# Altium project Power Converter 12V as TO-3 replacement.PrjPcb
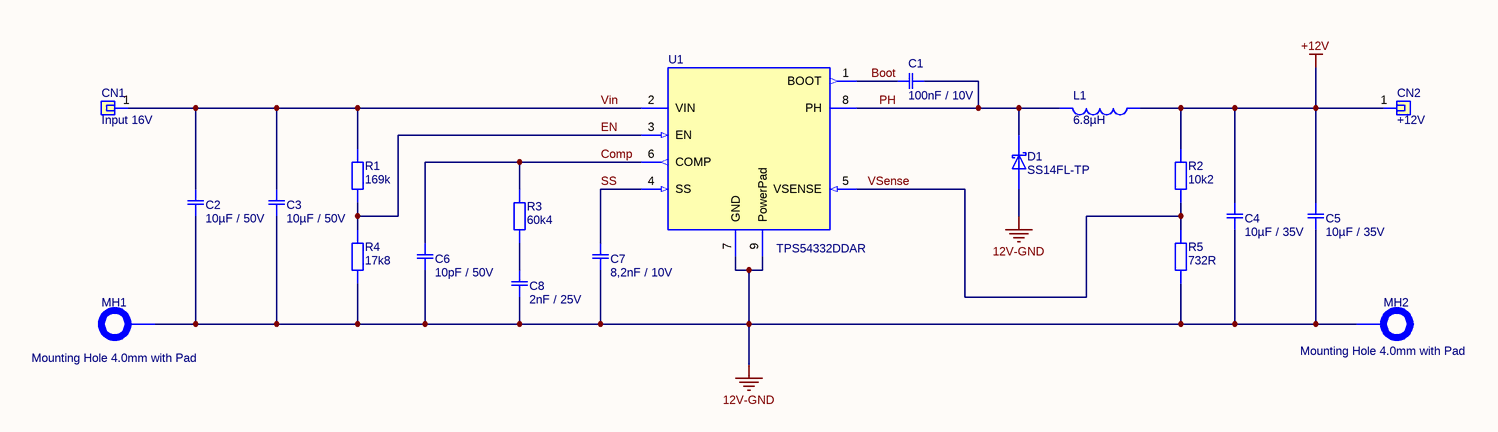
[diagram p0: Power Converter 12V as TO-3 replacement.SchDoc]
Author: PCB-Tech; Revision: A; Title: Projektname; Version: 1.0
1 sheet, 20 parts. Net scope: global (net labels, ports and power ports of the same name join across sheets).
Board file: Power Converter 12V as TO-3 replacement.PcbDoc

## Sheet Power Converter 12V as TO-3 replacement.SchDoc: Projektname
size 297 x 209 mm; ApprovedBy: .; CheckedBy: .; Author: DiWou; CompanyName: DL2DW; DrawnBy: DiWou; Engineer: .; Organization: DL2DW; DocumentNumber: 1; Revision: -; SheetNumber: 1; SheetTotal: 1; DrawnDate: 06.08.2020; EngrDate: .; ChkdDate: .; Title1: Power Converter 12V as TO-3 replacement; Title2: .; Title3: .; Desc1: Version 1.0; Desc2: .; ApprDate: .

### Parts
C1  100nF / 10V  [CAP CER SMD 0402 100nF 10V Murata GRM155R71A104KA01D]
C2  10µF / 50V  [CAP SMD 10µF 50V 1210 TDK C3225X7R1H106M250AC]
C3  10µF / 50V  [CAP SMD 10µF 50V 1210 TDK C3225X7R1H106M250AC]
C4  10µF / 35V  [CAP SMD 10µF 50V 1210 TDK C3216X6S1V106K160AC]
C5  10µF / 35V  [CAP SMD 10µF 50V 1210 TDK C3216X6S1V106K160AC]
C6  10pF / 50V  [CAP CER SMD 0805 10pF 50V Samsung CL21C100JBANNNC]
C7  8,2nF / 10V  [CAP CER SMD 0201 8,2nF 10V Murata GRM033R71A822KA01D]
C8  2nF / 25V  [CAP CER SMD 0805 2nF 25V Kemet C0805C202J3GACTU]
CN1  Input 16V  [Printed Circuit Pin 1.02mm 3125-2-00-80-00-00-08-0]
CN2  +12V  [Printed Circuit Pin 1.02mm 3125-2-00-80-00-00-08-0]
D1  SS14FL-TP  [SS14FL]
L1  6.8µH  [Shielded Drum Core 6.8µH TDK B82464G4682M]
MH1  Mounting Hole 4.0mm with Pad  [Mounting Hole 4mm with Pad]  (no BOM)
MH2  Mounting Hole 4.0mm with Pad  [Mounting Hole 4mm with Pad]  (no BOM)
R1  169k  [RES SMD 0402 169k Vishay CRCW0402169KFKED]
R2  10k2  [RES SMD 0402 10k2 Vishay CRCW040210K2FKED]
R3  60k4  [RES SMD 0402 60k4 Vishay CRCW040260K4FKED]
R4  17k8  [RES SMD 0402 17k8 Vishay CRCW040217K8FKED]
R5  732R  [RES SMD 0402 732R Vishay CRCW0402732RFKED]
U1  TPS54332DDAR  [DC-DC Converter (Buck) TPS54332DDAR SO-Power Pad]

### Nets
12V-GND: C2.1 C3.1 C4.1 C5.1 C6.1 C7.1 C8.2 D1.2 MH1.1 MH2.1 R4.1 R5.1 U1.7(GND) U1.9(PowerPad)
+12V: C4.2 C5.2 CN2.1 L1.2 R2.2
Boot: C1.1 U1.1(BOOT)
Comp: C6.2 R3.2 U1.6(COMP)
EN: R1.1 R4.2 U1.3(EN)
PH: C1.2 D1.1 L1.1 U1.8(PH)
SS: C7.2 U1.4(SS)
Vin: C2.2 C3.2 CN1.1 R1.2 U1.2(VIN)
VSense: R2.1 R5.2 U1.5(VSENSE)
NetC8_1: C8.1 R3.1

### Notes on the sheet
- Drawn by:
- Date
- Size:
- A4
- Rev:
- Engr:
- Chkd:
- Appr:
- File:
- Document No:
- Print Date & Time:
- /
- Sheet
- of

### Library data of the parts
C1 = CMP-Capacitors-Ceramic_Capacitors-00034-2: CAP CER 0.1UF 10V X7R 0402; Tolerance: 10%; Dissipation Factor: 0.035%; Number of Pins: 2; Termination: SMD/SMT; REACH SVHC: No SVHC; Length: 1mm; Case Code (Metric): 1005; Dielectric: X7R; Capacitance: 100nF; Width: 0.02inch; Package Quantity: 1; Packaging: Tape and Reel; Height: 0.5mm; Thickness: 0.022inch; Max Operating Temperature: 125°C; Voltage: 10V; Voltage Rating (DC): 10V; Depth: 0.5mm; Case Code (Imperial): 0402; Radiation Hardening: No; Case/Package: 0402; Min Operating Temperature: -55°C; Voltage Rating: 10V; Mount: Surface Mount; Lead Free: Lead Free
C2 C3 = CMP-Capacitors-Ceramic_Capacitors-00030-1: TDK - C3225X7R1H106M250AC - C3225X7R1H106MT000E; Dielectric: X7R; Capacitance: 10uF; Tolerance: 20%; Case/Package: 1210; Package Quantity: 1000; Case Code (Imperial): 1210; Thickness: 0.11inch; Min Operating Temperature: -55°C; Width: 0.098inch; Termination: SMD/SMT; Dielectric Material: Ceramic; Case Code (Metric): 3225; Height: 2.5mm; Voltage Rating: 50V; Packaging: Tape and Reel; REACH SVHC: No SVHC; Length: 0.126inch; Voltage Rating (DC): 50V; Mount: Surface Mount; Weight: 0.000564oz; Lead Free: Lead Free; Max Operating Temperature: 125°C
C4 C5 = CMP-Capacitors-Ceramic_Capacitors-00035-1: Cap Ceramic 10uF 35V X6S 10% SMD 1206 105°C Punched Paper T/R; Lead Free: Lead Free; Weight: 0.000571oz; Height: 1.6mm; Length: 0.126inch; Voltage Rating: 35V; Packaging: Tape and Reel; Voltage Rating (DC): 35V; Mount: Surface Mount; Termination: SMD/SMT; Case/Package: 1206; Dielectric Material: Ceramic; Min Operating Temperature: -55°C; Thickness: 0.071inch; Package Quantity: 2000; Max Operating Temperature: 105°C; Capacitance: 10uF; Width: 0.063inch; Case Code (Metric): 3216; Case Code (Imperial): 1206; Dielectric: X6S; Tolerance: 10%
C6 = CMP-Capacitors-Ceramic_Capacitors-00031-1: Cap Ceramic 10pF 50VDC C0G 5% SMD 0805 Paper T/R; Max Operating Temperature: 125°C; Radiation Hardening: No; Case/Package: 0805; Case Code (Metric): 2012; Mount: Surface Mount; Contact Plating: Tin; Tolerance: 5%; Depth: 1.25mm; Case Code (Imperial): 0805; Min Operating Temperature: -55°C; Thickness: 0.03inch; Package Quantity: 1; Height: 0.65mm; Length: 2mm; Voltage Rating: 50V; Capacitance: 10pF; Packaging: Tape and Reel; Dielectric: C0G; Width: 0.049inch
C7 = CMP-Capacitors-Ceramic_Capacitors-00033-1: Multilayer Ceramic Capacitors MLCC - SMD/SMT 0.0082uF 10volts 10%; Dielectric: X7R; Capacitance: 8.2nF; Tolerance: 10%; Thickness: 0.013inch; Height: 0.3mm; Max Operating Temperature: 125°C; Voltage Rating (DC): 10V; Voltage Rating: 10V; Package Quantity: 15000; Width: 0.012inch; Min Operating Temperature: -55°C; Case Code (Imperial): 0201; Packaging: Tape and Reel; Termination: SMD/SMT; Case Code (Metric): 0603; Length: 0.6mm; Mount: Surface Mount; Radiation Hardening: No; Depth: 0.3mm; Case/Package: 0201
C8 = CMP-Capacitors-Ceramic_Capacitors-00032-1: Multilayer Ceramic Capacitors MLCC - SMD/SMT 25volts 2000pF C0G 5%; Dissipation Factor: 0.1%; Dielectric Material: Ceramic; Voltage Rating (DC): 25V; Mount: Surface Mount; Package Quantity: 4000; Case Code (Imperial): 0805; Termination: SMD/SMT; Case/Package: 0805; Dielectric: C0G; Length: 2mm; Tolerance: 5%; Packaging: Tape and Reel; Voltage Rating: 25V; Height: 0.78mm; Min Operating Temperature: -55°C; Thickness: 0.035inch; Case Code (Metric): 2012; Lead Pitch: 0.75mm; Max Operating Temperature: 125°C; Capacitance: 2nF; Depth: 1.25mm; REACH SVHC: No SVHC; Width: 1.2mm; Lead Free: Lead Free
CN1 CN2 = CMP-Mechanicals-00020-1: CONN PC PIN CIRC 0.040DIA TIN; Gender: Male; Board Thickness: 0.062inch; Hole Diameter: 1.09mm; Insulation: Non-Insulated; Mounting Hole Diameter: 0.043inch; Outside Diameter: 1.8mm; Flange Diameter: 0.071inch; Plating: Tin; Packaging: Bulk; Termination: PC Pin; Contact Material: Brass; Mount: Through Hole; Contact Plating: Tin; Length: 0.402inch; Package Quantity: 500; Material: Brass
D1 = CMP-Diodes-00014-2: DIODE SCHOTTKY 40V 1A DO221AC; Packaging: Tape and Reel; Average Rectified Current: 1A; Max Reverse Voltage (DC): 40V; Mount: Surface Mount
L1 = CMP-Inductors-00013-1: Inductor Power Shielded Wirewound 6.8uH 20% 100KHz Ferrite 4.3A 0.02Ohm DCR Automotive T/R; DC Resistance (DCR): 20mR; Self Resonant Frequency: 28MHz; Current Rating: 2A; Saturation Current: 4.6A; Max Operating Temperature: 150°C; DC Current: 4.3A; Depth: 10.4mm; Military Standard: Not; Radiation Hardening: No; Max DC Current: 4.3A; Composition: Wirewound; Package Quantity: 750; Weight: 0.070548oz; Length: 10.4mm; Core Material: Ferrite; Inductance Tolerance: 20%; Mount: Surface Mount; Width: 10.4mm; Height: 4.8mm; Test Frequency: 100kHz; Height - Seated (Max): 0.189inch; Tolerance: 20%; Termination: SMD/SMT; RMS Current (Irms): 4.3A; Packaging: Tape and Reel; Min Operating Temperature: -55°C; Inductance: 6.8uH; Lead Free: Lead Free; REACH SVHC: No SVHC; Ratings: AEC-Q200; Shielding: Shielded; Case/Package: Nonstandard
MH1 MH2 = CMP-Mechanicals-00019-2
R1 = CMP-Resistors-00008-1: VISHAY - CRCW0402169KFKED - RES, THICK FILM, 169K, 1%, 0.063W, 0402, REEL; Voltage Rating: 50V; Max Power Dissipation: 63mW; Temperature Coefficient: 100ppm/°C; Resistance: 169kR; Case Code (Metric): 1005; Mount: Surface Mount; Number of Pins: 2; Width: 0.02inch; Lead Free: Lead Free; Contact Plating: Tin; Depth: 0.5mm; Height: 0.35mm; Case/Package: 0402; Max Operating Temperature: 155°C; Power Rating: 63mW; Tolerance: 1%; Composition: Thick Film; Packaging: Tape and Reel; Min Operating Temperature: -55°C; Radiation Hardening: No; Military Standard: Not; Case Code (Imperial): 0402; Weight: 2.3E-05oz; REACH SVHC: Unknown; Voltage Rating (DC): 50V; Package Quantity: 10; Number of Terminations: 2; Features: Automotive AEC-Q200; Length: 1mm; Termination: SMD/SMT
R2 = CMP-Resistors-00024-1: VISHAY         CRCW040210K2FKED.            Surface Mount Chip Resistor, Thick Film, AEC-Q200 CRCW Series, 10.2 kohm, 63 mW,  1%, 50 V; Temperature Coefficient: 100ppm/°C; Resistance: 10.2kR; Power Rating: 63mW; Voltage Rating: 50V; Military Standard: Not; Depth: 0.5mm; Case Code (Imperial): 0402; Weight: 2.3E-05oz; Composition: Thick Film; Length: 1mm; Radiation Hardening: No; Features: Automotive AEC-Q200; Number of Pins: 2; Max Power Dissipation: 63mW; Contact Plating: Tin; REACH SVHC: Unknown; Max Operating Temperature: 155°C; Termination: SMD/SMT; Mount: Surface Mount; Number of Terminations: 2; Width: 0.5mm; Min Operating Temperature: -55°C; Package Quantity: 10; Tolerance: 1%; Case Code (Metric): 1005; Packaging: Tape and Reel; Height: 0.35mm; Case/Package: 0402
R3 = CMP-Resistors-00010-1: VISHAY - CRCW040260K4FKED - SMD Chip Resistor, 0402 [1005 Metric], 60.4 kohm, CRCW e3 Series, 50 V, Thick Film, 63 mW; Power Rating: 63mW; Tolerance: 1%; Voltage Rating: 50V; Resistance: 60.4kR; Temperature Coefficient: 100ppm/°C; Case Code (Imperial): 0402; Contact Plating: Tin; Composition: Thick Film; Packaging: Tape and Reel; Max Operating Temperature: 155°C; Package Quantity: 10000; Width: 0.02inch; Length: 1mm; Weight: 2.3E-05oz; Min Operating Temperature: -55°C; Lead Free: Lead Free; Height: 0.35mm; Termination: SMD/SMT; Radiation Hardening: No; Case/Package: 0402; Depth: 0.5mm; Voltage Rating (DC): 50V; Case Code (Metric): 1005; REACH SVHC: Unknown; Features: Automotive AEC-Q200; Max Power Dissipation: 63mW; Military Standard: Not; Number of Terminations: 2
R4 = CMP-Resistors-00009-1: VISHAY - CRCW040217K8FKED - RES, THICK FILM, 17K8, 1%, 0.063W, 0402; Temperature Coefficient: 100ppm/°C; Voltage Rating: 50V; Resistance: 17.8kR; Max Power Dissipation: 63mW; Packaging: Tape and Reel; Case Code (Metric): 1005; Case Code (Imperial): 0402; Max Operating Temperature: 155°C; Height: 0.016inch; Features: Automotive AEC-Q200; Voltage Rating (DC): 50V; Tolerance: 1%; Termination: SMD/SMT; REACH SVHC: Unknown; Lead Free: Lead Free; Package Quantity: 10; Weight: 2.3E-05oz; Number of Terminations: 2; Composition: Thick Film; Min Operating Temperature: -55°C; Number of Pins: 2; Case/Package: 0402; Military Standard: Not; Depth: 0.5mm; Length: 1mm; Power Rating: 63mW; Radiation Hardening: No; Width: 0.02inch; Contact Plating: Tin
R5 = CMP-Resistors-00017-1: RES, THICK FILM, 732R, 1%, 0.063W, 0402, REEL; Product Range:AEC-Q200 CRCW Series; Resistance:732ohm; Power Rating:63mW; Resistance Tolerance: 1%; Voltage Rating:50V; Resistor Case Style:0402 [1005 Metric]; Packaging:Tape & Reel ;RoHS Compliant: Yes; Max Power Dissipation: 63mW; Voltage Rating: 50V; Temperature Coefficient: 100ppm/°C; Package Quantity: 10; Min Operating Temperature: -55°C; Packaging: Tape and Reel; Lead Free: Lead Free; Power Rating: 63mW; Tolerance: 1%; Number of Terminations: 2; Weight: 2.3E-05oz; Contact Plating: Tin; Depth: 0.5mm; Width: 0.5mm; Case/Package: 0402; Max Operating Temperature: 155°C; Voltage Rating (DC): 50V; Radiation Hardening: No; Case Code (Imperial): 0402; Termination: SMD/SMT; Case Code (Metric): 1005; Height: 0.35mm; Resistance: 732R; REACH SVHC: Unknown; Number of Pins: 2; Composition: Thick Film; Length: 1mm; Features: Automotive AEC-Q200; Military Standard: Not
U1 = CMP-ICs-Power_Supply-00013-5: TEXAS INSTRUMENTS - TPS54332DDAR - DC/DC CONV, BUCK, 1MHZ, SOIC-8; Quiescent Current: 82uA; Min Output Voltage: 800mV; Output Configuration: Positive; Synchronous Rectifier: No; Number of Outputs: 1; Output Type: Adjustable; Max Output Current: 3.5A; Max Output Voltage: 26.04V; Operating Supply Voltage: 28V; Min Supply Voltage: 3.5V; Output Voltage: 25V; Lead Free: Contains Lead; Length: 5mm; Max Operating Temperature: 150°C; Number of Pins: 8; REACH SVHC: No SVHC; Contact Plating: Gold; Package Quantity: 2500; Max Input Voltage: 28V; Output Current: 3.5A; Width: 4mm; Packaging: Tape and Reel; Mount: Surface Mount; Radiation Hardening: No; Min Operating Temperature: -40°C; Switching Frequency: 1MHz; Height: 1.55mm; Min Input Voltage: 3.5V; Weight: 0.00249oz